# EasyEDA schematic lora_schematic_source.json

## Sheets
1 Sheet_1: TITLE: LoRa; REV: 1.0; Date: 2024-10-14; Sheet: 1/1; Drawn By: gupta06ayush30; Company: Ayush Gupta
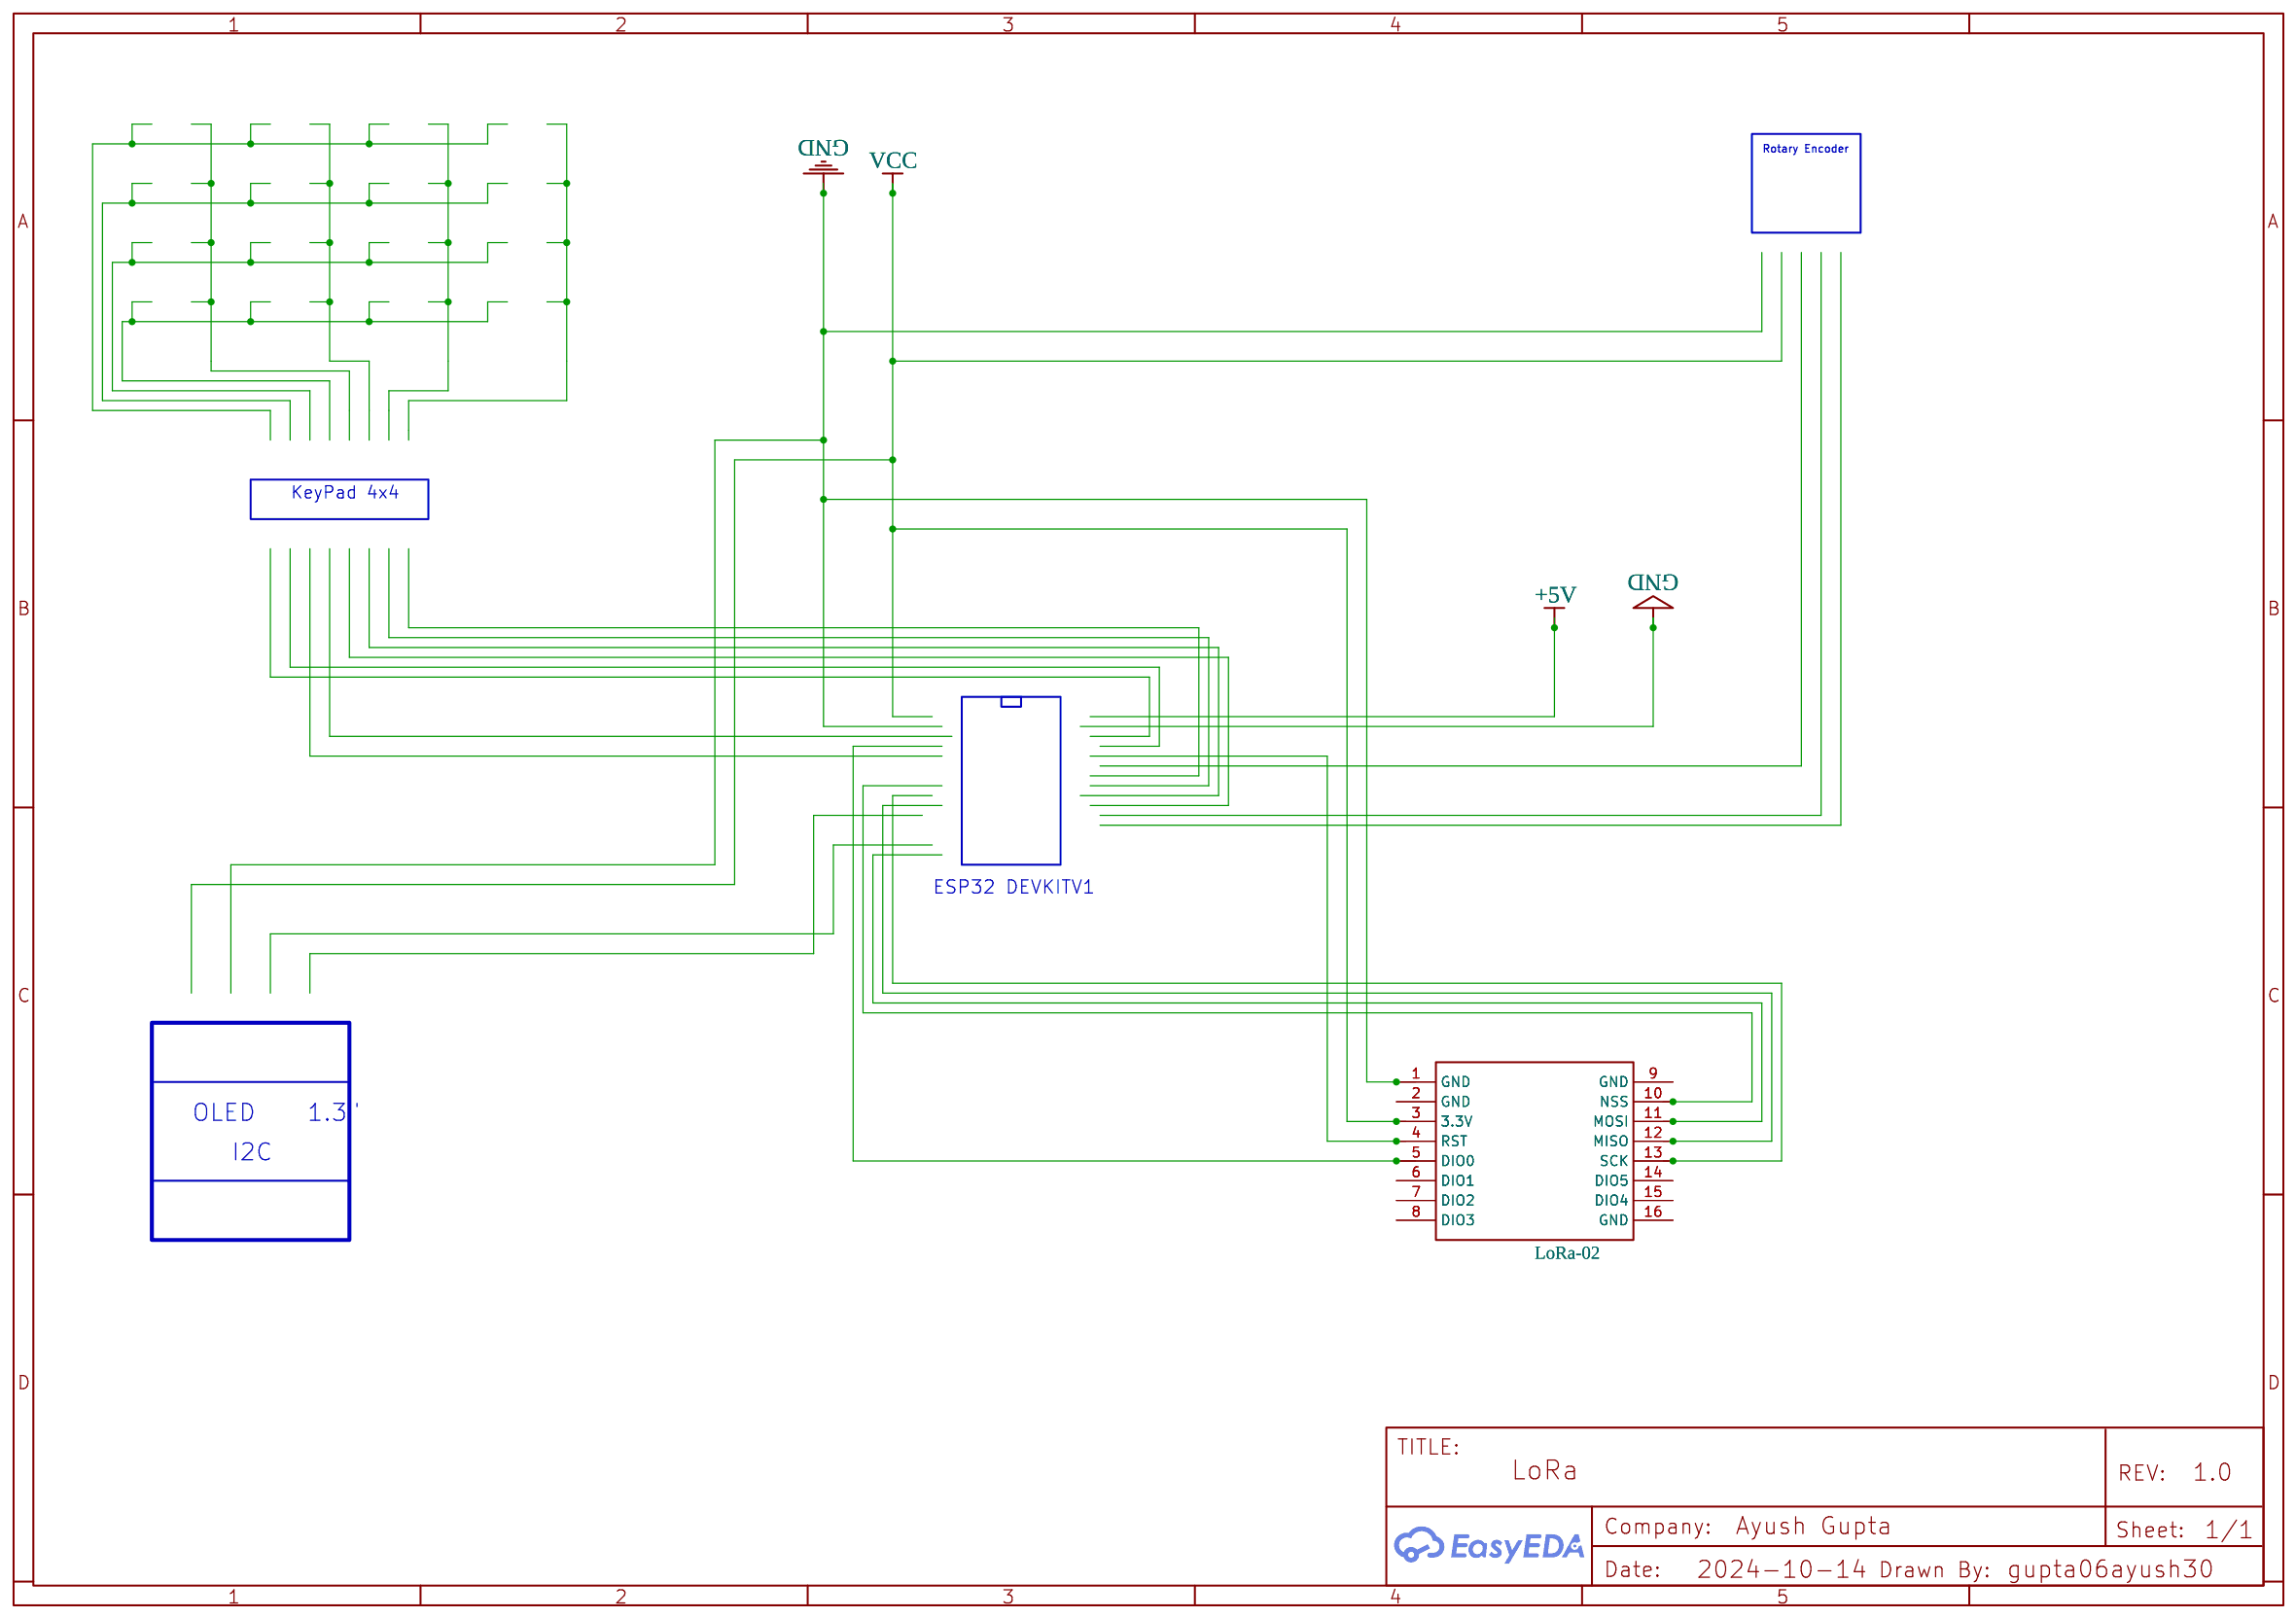
[diagram p0: Sheet_1]
2 Sheet_2
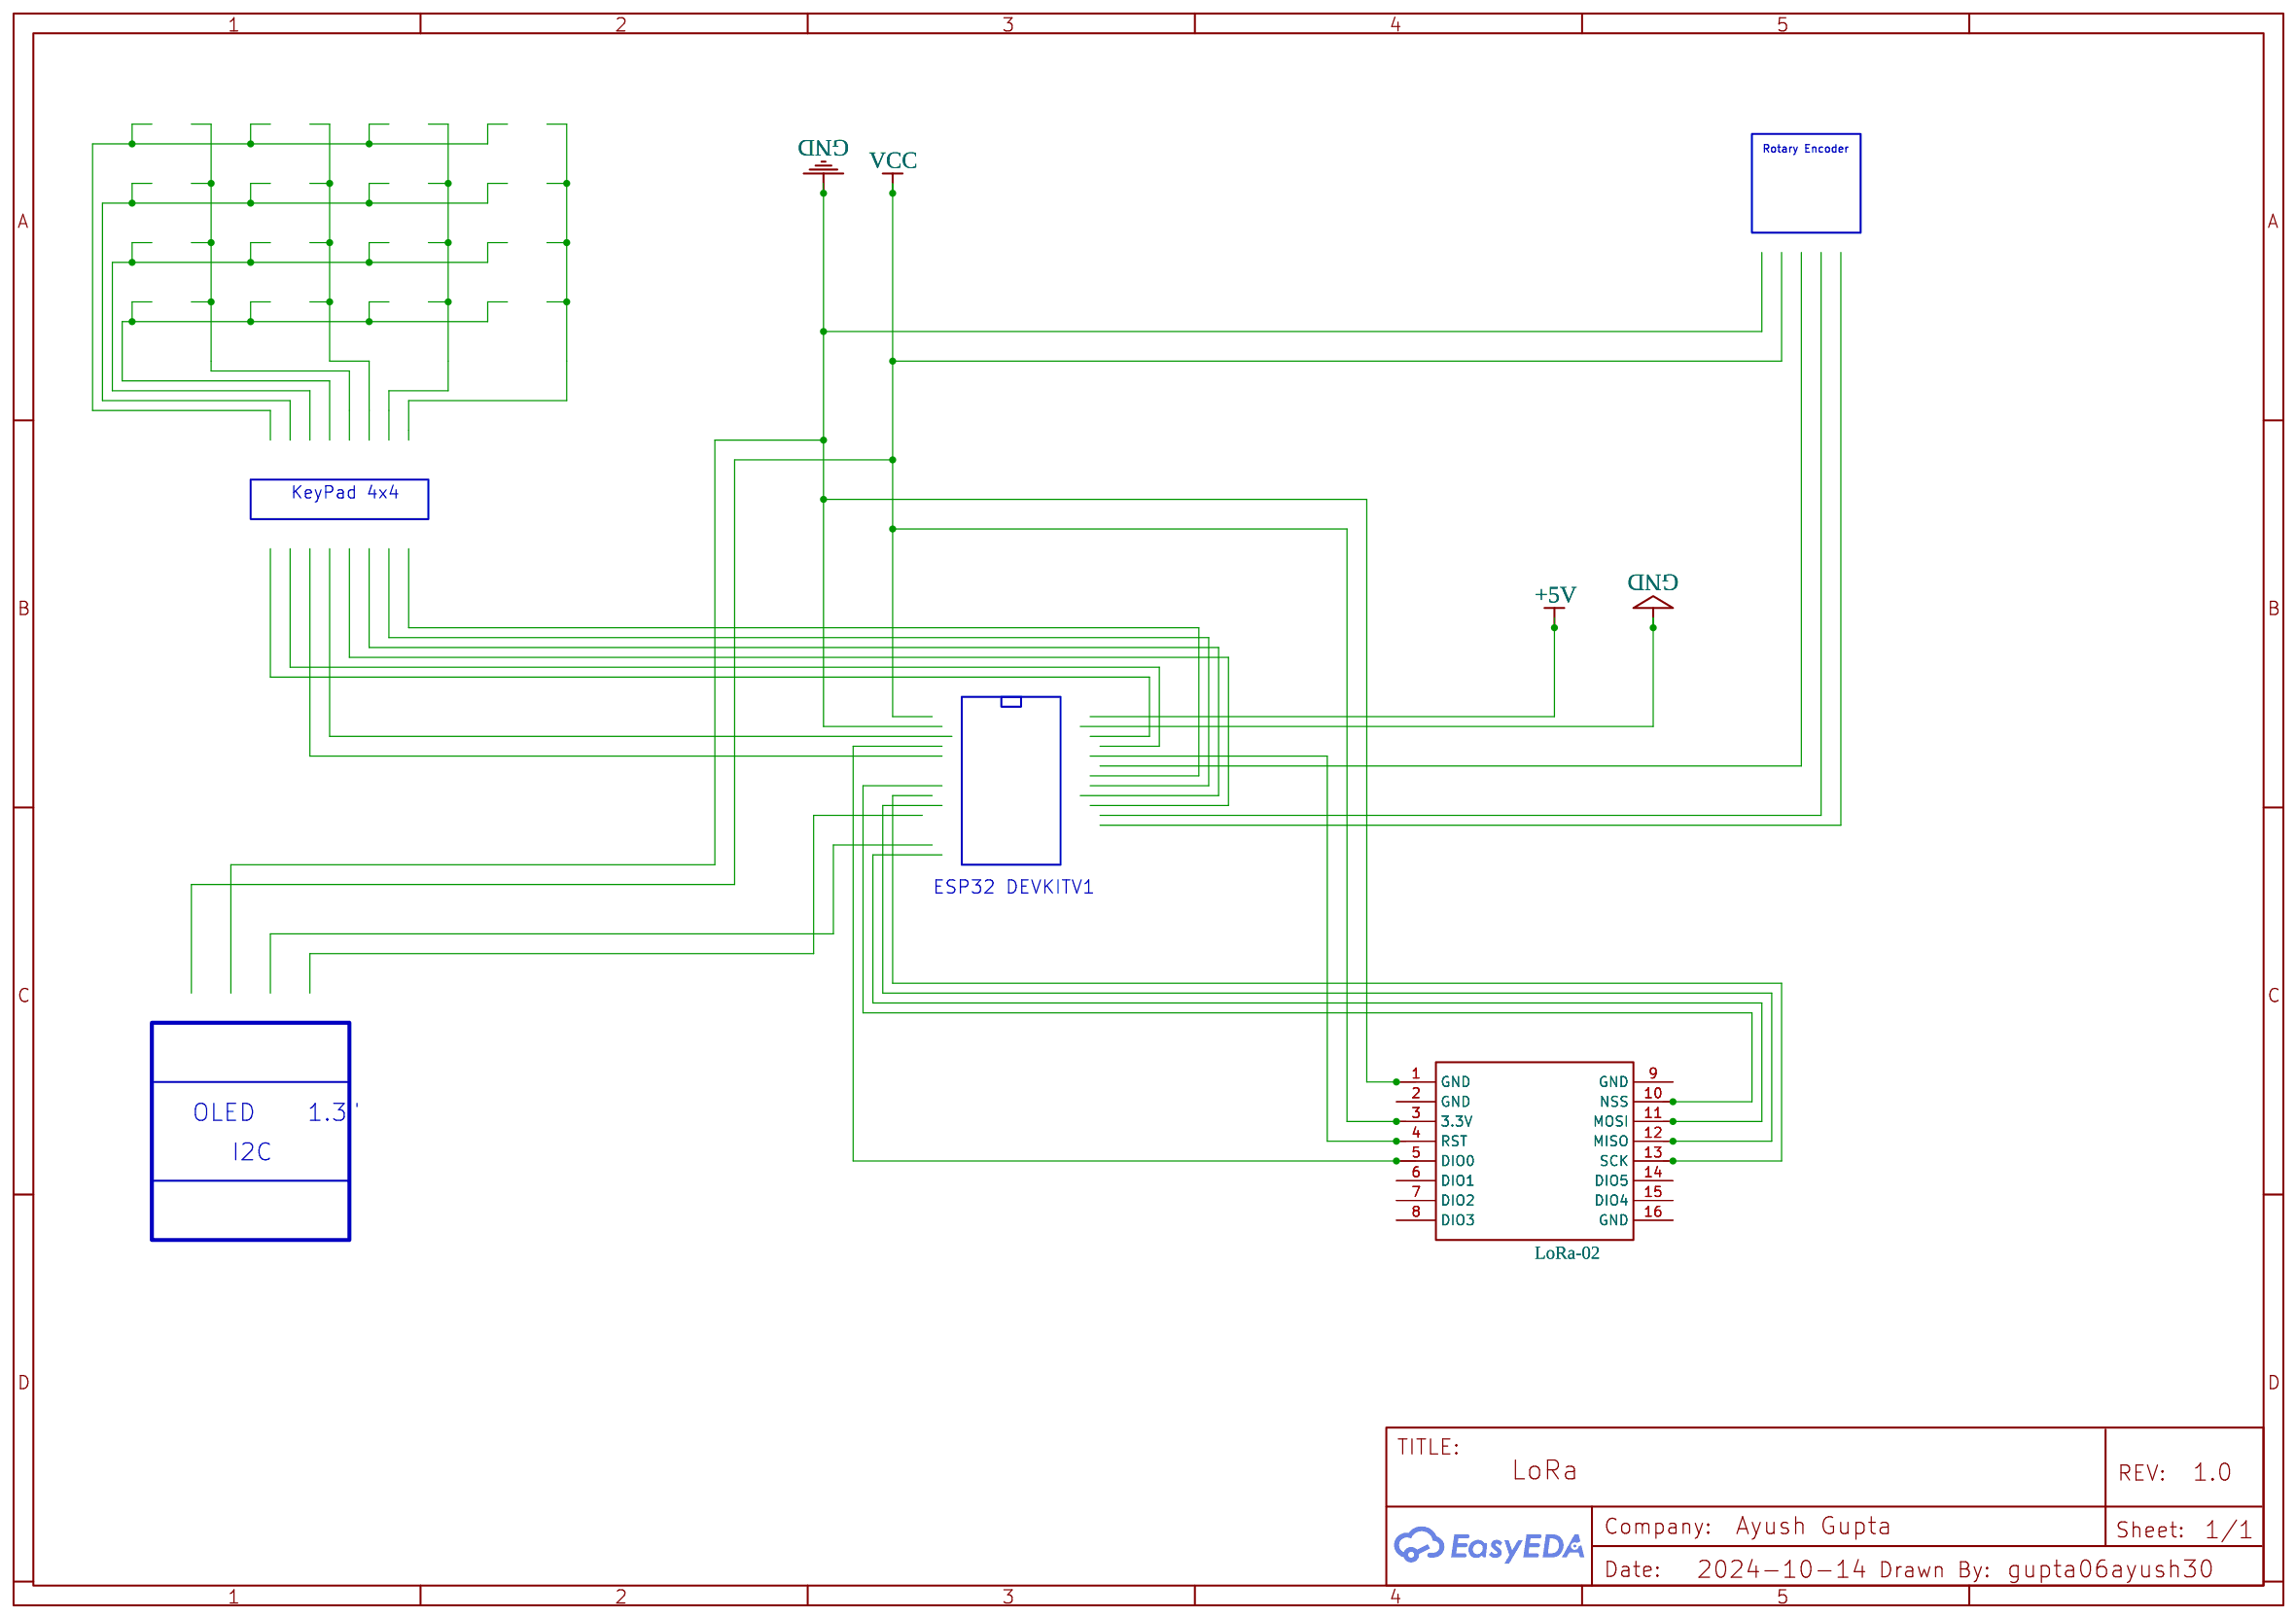
[diagram p1: Sheet_2]

## Parts
sheet Sheet_1
RF1  LoRa-02  [WIRELM-SMD_LORA1278-C1]
sheet Sheet_2
RF1#2  LoRa-02

## Nets
GND: RF1.1(GND) RF1#2.1(GND)
VCC: RF1.3(3.3V) RF1#2.3(3.3V)

Not connected (* = marked no-connect by the designer): RF1 2(GND) 4(RST) 5(DIO0) 6(DIO1) 7(DIO2) 8(DIO3) 9(GND) 10(NSS) 11(MOSI) 12(MISO) 13(SCK) 14(DIO5) 15(DIO4) 16(GND); RF1#2 2(GND) 4(RST) 5(DIO0) 6(DIO1) 7(DIO2) 8(DIO3) 9(GND) 10(NSS) 11(MOSI) 12(MISO) 13(SCK) 14(DIO5) 15(DIO4) 16(GND)

## Notes on the sheets
sheet 1
- Rotary Encoder
- KeyPad 4x4
- ESP32 DEVKITV1
- OLED    1.3"
- I2C
sheet 2
- Rotary Encoder
- KeyPad 4x4
- ESP32 DEVKITV1
- OLED    1.3"
- I2C
